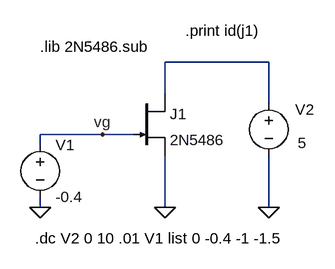
[diagram p0: schematic Medicion_JFETN_DCSweep.asc]
Medicion_JFETN_DCSweep.asc, the LTspice schematic file:
Version 4
SHEET 1 2680 1460
WIRE 880 816 720 816
WIRE 720 864 720 816
WIRE 880 880 880 816
WIRE 624 928 528 928
WIRE 672 928 624 928
WIRE 528 944 528 928
WIRE 528 1040 528 1024
WIRE 720 1040 720 960
WIRE 880 1040 880 960
FLAG 720 1040 0
FLAG 624 928 vg
FLAG 528 1040 0
FLAG 880 1040 0
SYMBOL voltage 880 864 R0
WINDOW 0 41 25 Left 2
WINDOW 3 45 77 Left 2
WINDOW 123 0 0 Left 2
WINDOW 39 0 0 Left 2
SYMATTR InstName V2
SYMATTR Value 5
SYMBOL njf 672 864 R0
SYMATTR InstName J1
SYMATTR Value 2N5486
SYMBOL voltage 528 928 R0
SYMATTR InstName V1
SYMATTR Value -0.4
TEXT 528 792 Left 2 !.lib 2N5486.sub
TEXT 752 768 Left 2 !.print id(j1)
TEXT 520 1088 Left 2 !.dc V2 0 10 .01 V1 list 0 -0.4 -1 -1.5

The netlist it stands for:
* Medicion_JFETN_DCSweep.asc
V2 N001 0 5
J1 N001 vg 0 2N5486
V1 vg 0 -0.4
.model NJF NJF
.model PJF PJF
.lib standard.jft
.lib 2N5486.sub
.print id(j1)
.dc V2 0 10 .01 V1 list 0 -0.4 -1 -1.5
.backanno
.end